# Altium project OSD335-X_Devboard.PrjPcb (part 2 of 3)

## Sheet P03_UART_Debug.SchDoc
size A4
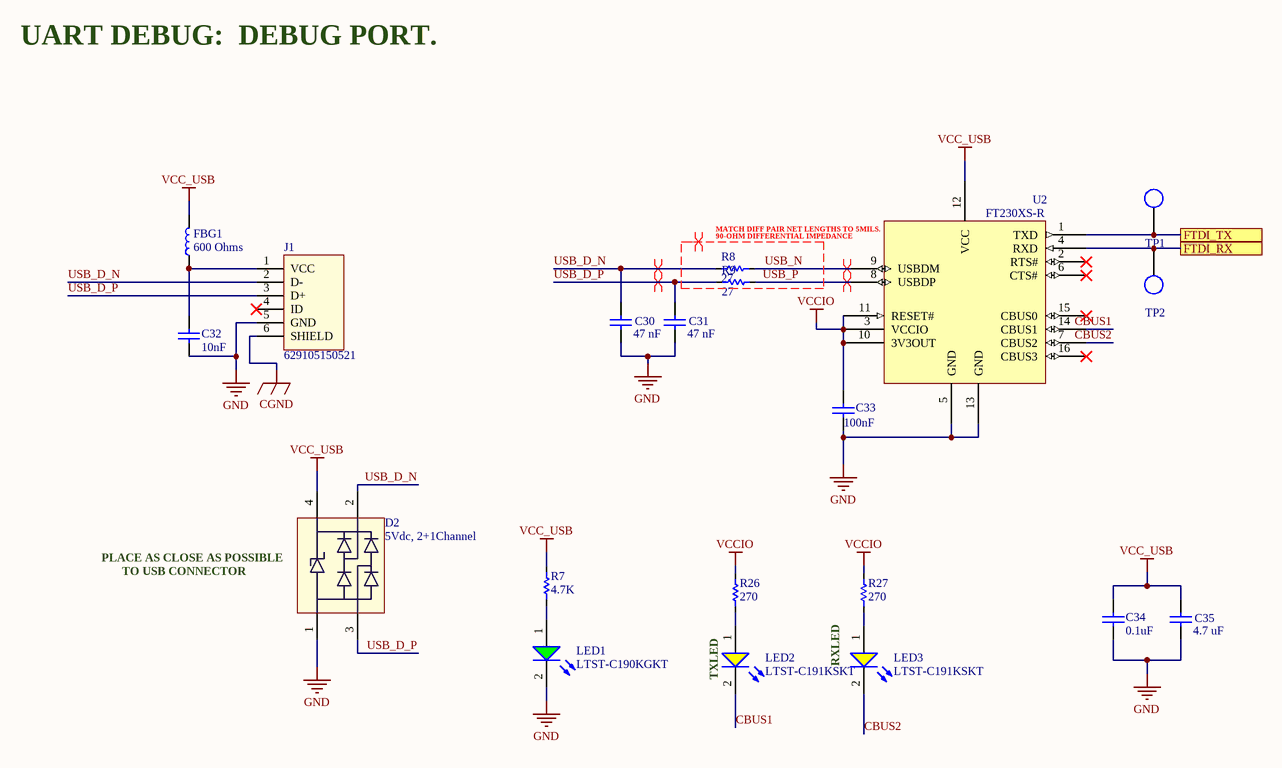
[diagram p4: P03_UART_Debug.SchDoc]

### Parts
C30  47 nF  [CAP_0603]
C31  47 nF  [CAP_0603]
C32  10nF  [CAP_0603]
C33  100nF  [CAP_0603]
C34  0.1uF  [CAP_0603]
C35  4.7 uF  [CAP_0603]
D2  5Vdc, 2+1Channel  [SOT143-4L]
FBG1  600 Ohms  [CAP_0603]
J1  629105150521  [629105150521]
LED1  LTST-C190KGKT  [LED_0603]
LED2  LTST-C191KSKT  [LED_0603]
LED3  LTST-C191KSKT  [LED_0603]
R7  4.7K  [RES_0603]
R8  27  [RES_0603]
R9  27  [RES_0603]
R26  270  [RES_0603]
R27  270  [RES_0603]
TP1  TP_SMD  [TP_SMD]  (value not drawn)
TP2  TP_SMD  [TP_SMD]  (value not drawn)
U2  FT230XS-R  [SOP64P600X175-16N]

### Ports
FTDI_RX, FTDI_TX

### Nets
CGND: J1.6(SHIELD)
GND: C30.2(P) C31.2(P) C32.1 C33.1 C34.1 C35.1(N) D2.1(GND) J1.5(GND) LED1.2(C) U2.5(GND) U2.13(GND)
VCC_USB: C34.2 C35.2(P) D2.4(VDD) FBG1.2 R7.2 U2.12(VCC)
VCCIO: C33.2 R26.2 R27.2 U2.3(VCCIO) U2.10(3V3OUT) U2.11(RESET#)
CBUS1: LED2.2(C) U2.14(CBUS1)
CBUS2: LED3.2(C) U2.7(CBUS2)
USB_D_N: C30.1(N) D2.2(IO1) J1.2(D-) R8.1
USB_D_P: C31.1(N) D2.3(IO2) J1.3(D+) R9.1
USB_N: R8.2 U2.9(USBDM)
USB_P: R9.2 U2.8(USBDP)
NetC32_2: C32.2 FBG1.1 J1.1(VCC)
NetLED1_1: LED1.1(A) R7.1
NetLED2_1: LED2.1(A) R26.1
NetLED3_1: LED3.1(A) R27.1
NetTP1_1: TP1.1 U2.1(TXD) ; port FTDI_TX
NetTP2_1: TP2.1 U2.4(RXD) ; port FTDI_RX

Not connected (* = marked no-connect by the designer): J1 4(ID)*; U2 2(RTS#)* 6(CTS#)* 15(CBUS0)* 16(CBUS3)*

### Layout directives
differential pair; differential pair class USB; rule Matched Net Lengths [Tolerance = 5mil]: USB_D_N, USB_N
differential pair; net class Z90_DIFF: USB_N, USB_P
differential pair; differential pair class USB: USB_D_P, USB_P

### Notes on the sheet
- UART DEBUG:  DEBUG PORT.
- MATCH DIFF PAIR NET LENGTHS TO 5MILS.
- 90-OHM DIFFERENTIAL IMPEDANCE
- PLACE AS CLOSE AS POSSIBLE
- TO USB CONNECTOR
- (near LED2) TXLED
- (near LED3) RXLED

### Library data of the parts
C30 C31 = C0603C473K4RACTU: CAP CER 0.047UF 16V X7R 0603; Manufacturer: KEMET; Tolerance: 10%; Rated Voltage: 16 VDC; ComponentLink1Description: Manufacturer; ComponentLink1URL: http://www.we-online.de; ComponentLink2Description: Datasheet; ComponentLink2URL: https://katalog.we-online.com/pbs/datasheet/865080345012.pdf; Mounting Technology: SMD; Value: 47 nF; Manufacturer Part No.: C0603C473K4RACTU; Datasheet: https://api.kemet.com/component-edge/download/datasheet/C0603C473K4RACTU.pdf; Supplier: Digi-Key; Package Reference: CAP_0603; Supplier Part No.: 399-7932-2-ND; Package Description: 0603
C32 = C0603C104M4RACTU: CAP CER 10000PF 16V NPO 0805; Manufacturer: Yageo; Manufacturer Part No.: CC0805JKNPO7BN103; Ceramic Type: NP0; Tolerance: 5%; ComponentLink1Description: Manufacturer; ComponentLink1URL: http://www.we-online.de; Value: 10nF; Rated Voltage: 16V; Supplier Part No.: 311-4205-1-ND; Package Reference: CAP_0805; Package Description: 0805; Mounting Technology: SMD; Datasheet: https://www.yageo.com/upload/media/product/productsearch/datasheet/mlcc/UPY-GP_NP0_16V-to-50V_18.pdf; Supplier: Digi-Key; ComponentLink2Description: Datasheet; ComponentLink2URL: https://content.kemet.com/datasheets/KEM_C1002_X7R_SMD.pdf
C33 = C0603C104M4RACTU: CAP CER 100PF 16V NP0 0603; Manufacturer: KEMET; Manufacturer Part No.: C0603C101J4GAC7867; Ceramic Type: X7R; Tolerance: 5%; ComponentLink1Description: Manufacturer; ComponentLink1URL: http://www.we-online.de; Value: 100nF; Rated Voltage: 16V; Supplier Part No.: 399-14476-1-ND; Package Reference: CAP_0603; Package Description: 0603; Mounting Technology: SMD; Datasheet: https://api.kemet.com/component-edge/download/datasheet/C0603C101J4GACTU.pdf; Supplier: Digi-Key; ComponentLink2Description: Datasheet; ComponentLink2URL: https://content.kemet.com/datasheets/KEM_C1002_X7R_SMD.pdf
C34 = C0603C104K4PAC7867: CAP CER 0.1UF 16V X5R 0603; Manufacturer: KEMET; Tolerance: 5%; ComponentLink1Description: Manufacturer; ComponentLink1URL: http://www.we-online.de; Value: 0.1uF; Rated Voltage: 16V; Ceramic Type: X5R; Supplier Part No.: 399-14941-1-ND; Package Reference: CAP_0603; Package Description: 0603; Mounting Technology: SMD; Manufacturer Part No.: C0603C104K4PAC7867; Datasheet: https://api.kemet.com/component-edge/download/datasheet/C0603C104K4PAC7867.pdf; Supplier: Digi-Key; ComponentLink2Description: Datasheet; ComponentLink2URL: https://content.kemet.com/datasheets/KEM_C1002_X7R_SMD.pdf
C35 = C0603C473K4RACTU_1: CAP CER 4.7UF 16V X5R 0603; Manufacturer Part No.: GRM188R61C475KAAJD; Manufacturer: Murata Electronics; Tolerance: 10%; Rated Voltage: 16 VDC; ComponentLink1Description: Manufacturer; ComponentLink1URL: http://www.we-online.de; ComponentLink2Description: Datasheet; ComponentLink2URL: https://katalog.we-online.com/pbs/datasheet/865080345012.pdf; Mounting Technology: SMD; Value: 4.7 uF; Datasheet: https://search.murata.co.jp/Ceramy/image/img/A01X/G101/ENG/GRM188R61C475KAAJ-01.pdf; Supplier: Digi-Key; Package Reference: CAP_0603; Supplier Part No.: 490-10481-1-ND; Package Description: 0603
D2 = 8240026: TVS DIODE 5V 9V SOT143-4 ESD; Manufacturer: Wurth Elektronik; Reverse Breakdown Voltage min.: 6V; Channel: 2+1; Channel Input Capacitance: 1.2pF; Reverse Peak Pulse Current: 6A; Reverse Channel Leakage Current: 1uA; ComponentLink1Description: Manufacturer; ComponentLink1URL: http://www.we-online.de; ComponentLink2Description: Datasheet; ComponentLink2URL: https://katalog.we-online.com/pbs/datasheet/8240026.pdf; Mounting Technology: SMD; DC Operating Voltage: 5V; Supplier: Digi-Key; Manufacturer Part No.: 8240026; Supplier Part No.: 732-4470-1-ND; Datasheet: https://www.we-online.de/katalog/datasheet/8240026.pdf; Package Description: SOT143-4
FBG1 = Ferrite Bead Generic: 600 Ohms @ 100MHz Ferrite Bead 0603 2A 100mOhm; Manufacturer: Chilisin Electronics; Manufacturer Part No.: BBHV00160808601Y00; ComponentLink1Description: Manufacturer; ComponentLink1URL: http://www.we-online.de; Value: 600 Ohms; Supplier Part No.: 2184-BBHV00160808601Y00CT-ND; Package Reference: FB_0603; Package Description: 0603; Mounting Technology: SMD; Datasheet: https://www.chilisin.com/upload/media/product/emi_bead/file/BBHV_Series.pdf; Tolerance: -; Supplier: Digi-Key; ComponentLink2Description: Datasheet; ComponentLink2URL: https://content.kemet.com/datasheets/KEM_C1002_X7R_SMD.pdf; Rated Current: 2 A
J1 = 629105150521: CONN RCPT USB2.0 MICRO B SMD R/A; Manufacturer: Wurth Elektronik; ComponentLink1 Description: Manufacturer; ComponentLink2 Description: Datasheet; ComponentLink1URL: http://www.we-online.de; ComponentLink2URL: http://katalog.we-online.de/em/datasheet/629105150521.pdf; Supplier: Digi-Key; Mounting Technology: THRU/SMD; Supplier Part No.: 732-5960-1-ND; Package Description: MICRO USB TYPE B DEVICE RECEPTACLE; Manufacturer Part No.: 629105150521; Package Reference: 629105150521; Datasheet: https://www.we-online.de/katalog/datasheet/629105150521.pdf
LED1 = LTST-C190KGKT: LED GREEN CLEAR CHIP SMD 0603; Manufacturer: Lite-On Inc.; Vf: 2V; Test Current: 20 mA; ComponentLink1Description: Manufacturer; ComponentLink1URL: http://www.we-online.de; ComponentLink2Description: Datasheet; ComponentLink2URL: http://katalog.we-online.com/led/datasheet/150080BS75000.pdf; Color: Green; Manufacturer Part No.: LTST-C190KGKT; Supplier: Digi-Key; Package Reference: LED_0603; Supplier Part No.: 160-1435-1-ND; Mounting Technology: SMD; Datasheet: http://optoelectronics.liteon.com/upload/download/DS22-2000-074/LTST-C190KGKT.PDF
LED2 LED3 = LTST-C191KSKT: LED YELLOW CLEAR SMD 0603; Manufacturer: Lite-On Inc.; Vf: 2.1V; Test Current: 20 mA; ComponentLink1Description: Manufacturer; ComponentLink1URL: http://www.we-online.de; ComponentLink2Description: Datasheet; ComponentLink2URL: http://katalog.we-online.com/led/datasheet/150080BS75000.pdf; Color: Yellow; Manufacturer Part No.: LTST-C191KSKT; Supplier: Digi-Key; Package Reference: LED_0603; Supplier Part No.: 160-1448-1-ND; Mounting Technology: SMD; Datasheet: http://optoelectronics.liteon.com/upload/download/DS22-2000-224/LTST-C191KSKT.PDF
R7 = RC0603JR-074K7L: RES SMD 4.7K OHM 5% 1/10W 0603; Manufacturer: Yageo; Value: 4.7K; Tolerance: 5%; Manufacturer Part No.: RC0603JR-074K7L; Date: 2020; ComponentLink1Description: Manufacturer Link; ComponentLink1URL: http://www.vishay.com/company/brands/dale/; ComponentLink2Description: Datasheet; ComponentLink2URL: http://www.vishay.com/docs/20035/dcrcwe3.pdf; Supplier: Digikey; Supplier Part No.: 311-4.7KGRCT-ND; Datasheet: https://www.yageo.com/upload/media/product/productsearch/datasheet/rchip/PYu-RC_Group_51_RoHS_L_10.pdf; Package Reference: RES_0603; Package Description: 0603; Mounting Technology: SMD; Power Rating: 1/10W
R8 R9 = RC0603JR-0727RL: RES SMD 27 OHM 5% 1/10W 0603; Manufacturer: Yageo; Value: 27; Tolerance: 5%; Manufacturer Part No.: RC0603JR-0727RL; Date: 2020; ComponentLink1Description: Manufacturer Link; ComponentLink1URL: http://www.vishay.com/company/brands/dale/; ComponentLink2Description: Datasheet; ComponentLink2URL: http://www.vishay.com/docs/20035/dcrcwe3.pdf; Supplier: Digikey; Supplier Part No.: 311-27GRCT-ND; Datasheet: https://www.yageo.com/upload/media/product/productsearch/datasheet/rchip/PYu-RC_Group_51_RoHS_L_10.pdf; Package Reference: RES_0603; Package Description: 0603; Mounting Technology: SMD
R26 R27 = RC0603JR-07270RL: RES SMD 270 OHM 5% 1/10W 0603; Manufacturer: Yageo; Tolerance: 5%; Manufacturer Part No.: RC0603JR-07270RL; Date: 2020; ComponentLink1Description: Manufacturer Link; ComponentLink1URL: http://www.vishay.com/company/brands/dale/; ComponentLink2Description: Datasheet; ComponentLink2URL: http://www.vishay.com/docs/20035/dcrcwe3.pdf; Supplier: Digikey; Supplier Part No.: 311-270GRCT-ND; Datasheet: https://www.yageo.com/upload/media/product/productsearch/datasheet/rchip/PYu-RC_Group_51_RoHS_L_10.pdf; Package Reference: RES_0603; Package Description: 0603; Mounting Technology: SMD; Power Rating: 1/10W; Value: 270
U2 = FT230XS-R: IC USB SERIAL BASIC UART 16SSOP; Manufacturer: FTDI, Future Technology Devices International Ltd; Manufacturer Part No.: FT230XS-R; Supplier: Digi-Key; Mounting Technology: SMD; Supplier Part No.: 768-1135-1-ND; Datasheet: https://www.ftdichip.com/Support/Documents/DataSheets/ICs/DS_FT230X.pdf; Package Reference: SSOP-16; Package Description: USB Bridge, USB to UART USB 2.0 UART Interface 16-SSOP; ComponentLink1Description: Datasheet; ComponentLink1URL: https://www.ftdichip.com/Support/Documents/DataSheets/ICs/DS_FT230X.pdf

## Sheet HDMI.SchDoc
size A4
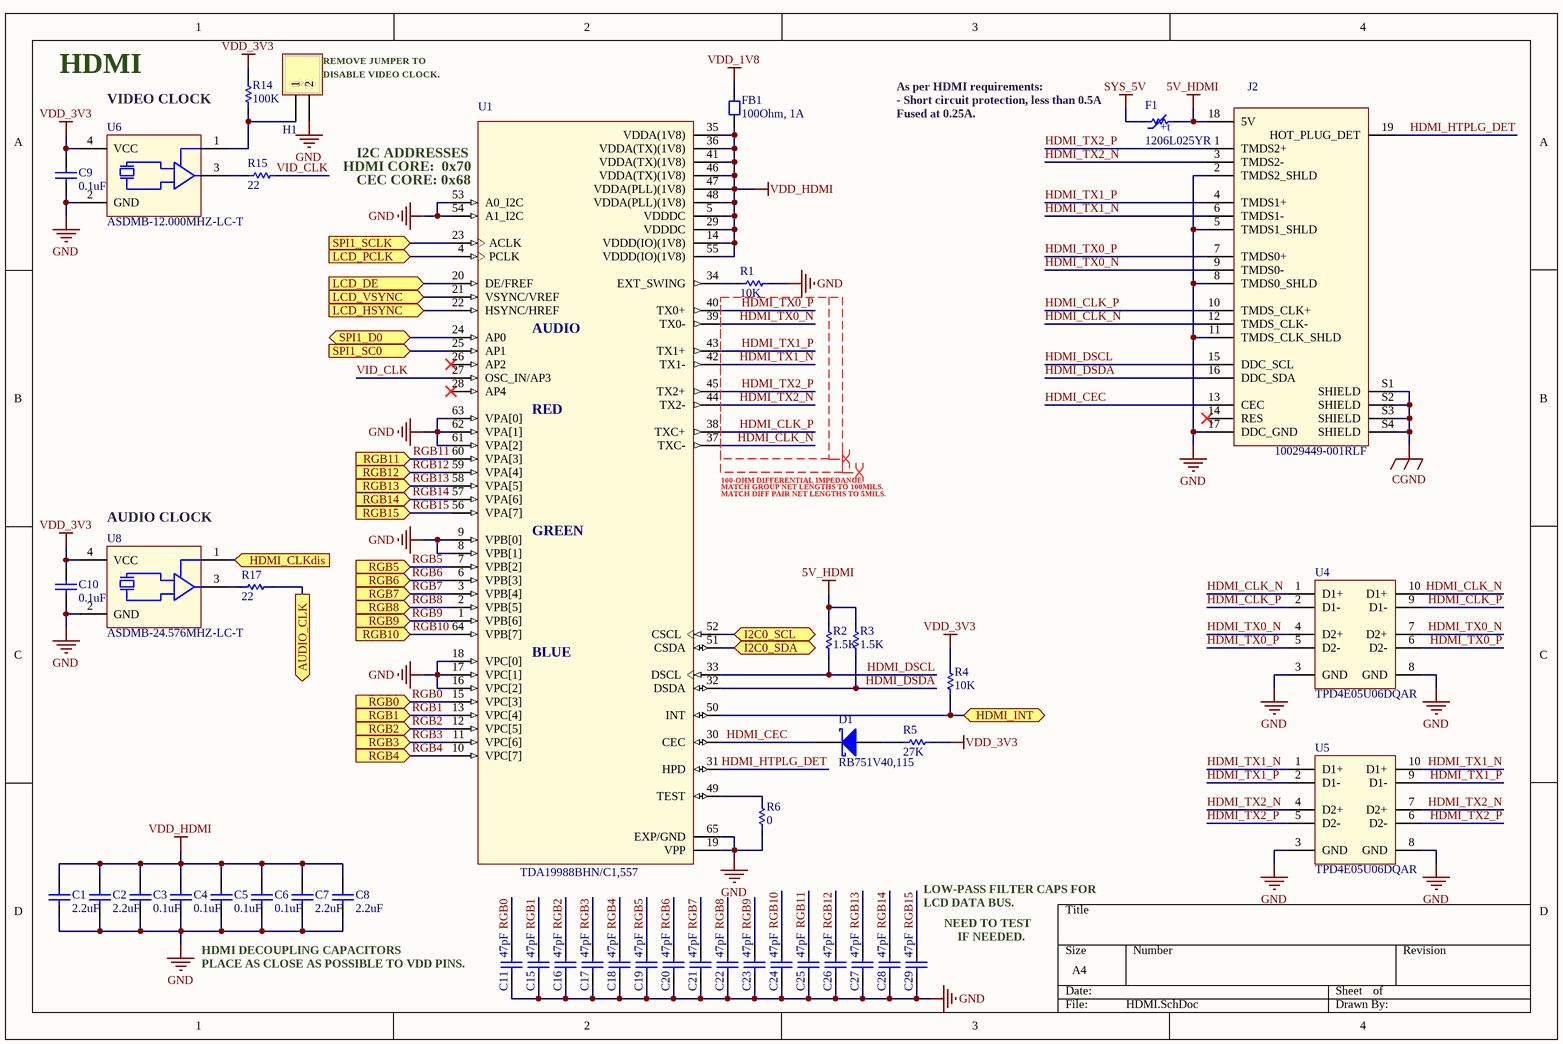
[diagram p5: HDMI.SchDoc]

### Parts
C1  2.2uF  [CAP_0603]
C2  2.2uF  [CAP_0603]
C3  0.1uF  [CAP_0603]
C4  0.1uF  [CAP_0603]
C5  0.1uF  [CAP_0603]
C6  0.1uF  [CAP_0603]
C7  2.2uF  [CAP_0603]
C8  2.2uF  [CAP_0603]
C9  0.1uF  [CAP_0603]
C10  0.1uF  [CAP_0603]
C11  47pF  [CAP_0402]
C15  47pF  [CAP_0402]
C16  47pF  [CAP_0402]
C17  47pF  [CAP_0402]
C18  47pF  [CAP_0402]
C19  47pF  [CAP_0402]
C20  47pF  [CAP_0402]
C21  47pF  [CAP_0402]
C22  47pF  [CAP_0402]
C23  47pF  [CAP_0402]
C24  47pF  [CAP_0402]
C25  47pF  [CAP_0402]
C26  47pF  [CAP_0402]
C27  47pF  [CAP_0402]
C28  47pF  [CAP_0402]
C29  47pF  [CAP_0402]
D1  RB751V40,115  [SOD-323]
F1  1206L025YR  [RES_1206]
FB1  100Ohm, 1A  [CAP_0603]
H1  02p  [HEADER_2X1_2.54MM]  (value not drawn)
J2  10029449-001RLF  [10029449-001RLF]
R1  10K  [RES_0603]
R2  1.5K  [RES_0603]
R3  1.5K  [RES_0603]
R4  10K  [RES_0603]
R5  27K  [RES_0603]
R6  0  [RES_0603]
R14  100K  [RES_0603]
R15  22  [RES_0603]
R17  22  [RES_0603]
U1  TDA19988BHN/C1,557  [HVQFN-64_9x9MM]
U4  TPD4E05U06DQAR  [USON-10_2.5X1MM]
U5  TPD4E05U06DQAR  [USON-10_2.5X1MM]
U6  ASDMB-12.000MHZ-LC-T  [ABRACON_4SMD_QFN]
U8  ASDMB-24.576MHZ-LC-T  [ABRACON_4SMD_QFN]

### Ports
AUDIO_CLK (out), HDMI_CLKdis (in), HDMI_INT (bidir), I2C0_SCL (bidir), I2C0_SDA (bidir), LCD_DE (in), LCD_HSYNC (in), LCD_PCLK (in), LCD_VSYNC (in), RGB0 (in), RGB1 (in), RGB2 (in), RGB3 (in), RGB4 (in), RGB5 (in), RGB6 (in), RGB7 (in), RGB8 (in), RGB9 (in), RGB10 (in), RGB11 (in), RGB12 (in), RGB13 (in), RGB14 (in), RGB15 (in), SPI1_D0 (bidir), SPI1_SC0 (in), SPI1_SCLK (in)

### Nets
5V_HDMI: F1.2 J2.18(5V) R2.2 R3.2
CGND: J2.S1(SHIELD) J2.S2(SHIELD) J2.S3(SHIELD) J2.S4(SHIELD)
GND: C1.1 C2.1 C3.1 C4.1 C5.1 C6.1 C7.1 C8.1 C9.1 C10.1 C11.1(N) C15.1(N) C16.1(N) C17.1(N) C18.1(N) C19.1(N) C20.1(N) C21.1(N) C22.1(N) C23.1(N) C24.1(N) C25.1(N) C26.1(N) C27.1(N) C28.1(N) C29.1(N) H1.2 J2.2(TMDS2_SHLD) J2.5(TMDS1_SHLD) J2.8(TMDS0_SHLD) J2.11(TMDS_CLK_SHLD) J2.17(DDC_GND) R1.1 R6.1 U1.8(VPB[1]) U1.9(VPB[0]) U1.16(VPC[2]) U1.17(VPC[1]) U1.18(VPC[0]) U1.19(VPP) U1.53(A0_I2C) U1.54(A1_I2C) U1.61(VPA[2]) U1.62(VPA[1]) U1.63(VPA[0]) U1.65(EXP/GND) U4.3(GND) U4.8(GND) U5.3(GND) U5.8(GND) U6.2(GND) U8.2(GND)
SYS_5V: F1.1
VDD_1V8: FB1.2
VDD_3V3: C9.2 C10.2 R4.2 R5.2 R14.2 U6.4(VCC) U8.4(VCC)
VDD_HDMI: C1.2 C2.2 C3.2 C4.2 C5.2 C6.2 C7.2 C8.2 FB1.1 U1.5(VDDDC) U1.14(VDDD(IO)(1V8)) U1.29(VDDDC) U1.35(VDDA(1V8)) U1.36(VDDA(TX)(1V8)) U1.41(VDDA(TX)(1V8)) U1.46(VDDA(TX)(1V8)) U1.47(VDDA(PLL)(1V8)) U1.48(VDDA(PLL)(1V8)) U1.55(VDDD(IO)(1V8))
HDMI_CEC: D1.2(K) J2.13(CEC) U1.30(CEC)
HDMI_CLK_N: J2.12(TMDS_CLK-) U1.37(TXC-) U4.1(D1+) U4.10(D1+)
HDMI_CLK_P: J2.10(TMDS_CLK+) U1.38(TXC+) U4.2(D1-) U4.9(D1-)
HDMI_DSCL: J2.15(DDC_SCL) R2.1 U1.33(DSCL)
HDMI_DSDA: J2.16(DDC_SDA) R3.1 U1.32(DSDA)
HDMI_HTPLG_DET: J2.19(HOT_PLUG_DET) U1.31(HPD)
HDMI_TX0_N: J2.9(TMDS0-) U1.39(TX0-) U4.4(D2+) U4.7(D2+)
HDMI_TX0_P: J2.7(TMDS0+) U1.40(TX0+) U4.5(D2-) U4.6(D2-)
HDMI_TX1_N: J2.6(TMDS1-) U1.42(TX1-) U5.1(D1+) U5.10(D1+)
HDMI_TX1_P: J2.4(TMDS1+) U1.43(TX1+) U5.2(D1-) U5.9(D1-)
HDMI_TX2_N: J2.3(TMDS2-) U1.44(TX2-) U5.4(D2+) U5.7(D2+)
HDMI_TX2_P: J2.1(TMDS2+) U1.45(TX2+) U5.5(D2-) U5.6(D2-)
RGB0: C11.2(P) U1.15(VPC[3]) ; port RGB0
RGB1: C15.2(P) U1.13(VPC[4]) ; port RGB1
RGB2: C16.2(P) U1.12(VPC[5]) ; port RGB2
RGB3: C17.2(P) U1.11(VPC[6]) ; port RGB3
RGB4: C18.2(P) U1.10(VPC[7]) ; port RGB4
RGB5: C19.2(P) U1.7(VPB[2]) ; port RGB5
RGB6: C20.2(P) U1.6(VPB[3]) ; port RGB6
RGB7: C21.2(P) U1.3(VPB[4]) ; port RGB7
RGB8: C22.2(P) U1.2(VPB[5]) ; port RGB8
RGB9: C23.2(P) U1.1(VPB[6]) ; port RGB9
RGB10: C24.2(P) U1.64(VPB[7]) ; port RGB10
RGB11: C25.2(P) U1.60(VPA[3]) ; port RGB11
RGB12: C26.2(P) U1.59(VPA[4]) ; port RGB12
RGB13: C27.2(P) U1.58(VPA[5]) ; port RGB13
RGB14: C28.2(P) U1.57(VPA[6]) ; port RGB14
RGB15: C29.2(P) U1.56(VPA[7]) ; port RGB15
VID_CLK: R15.2 U1.27(OSC_IN/AP3)
NetD1_1: D1.1(A) R5.1
NetH1_1: H1.1 R14.1 U6.1(STDBY)
NetR1_2: R1.2 U1.34(EXT_SWING)
NetR4_1: R4.1 U1.50(INT) ; port HDMI_INT
NetR6_2: R6.2 U1.49(TEST)
NetR10_2: U1.4(PCLK) ; port LCD_PCLK
NetR11_2: U1.21(VSYNC/VREF) ; port LCD_VSYNC
NetR12_2: U1.22(HSYNC/HREF) ; port LCD_HSYNC
NetR13_2: U1.20(DE/FREF) ; port LCD_DE
NetR15_1: R15.1 U6.3(OUT)
NetR17_1: R17.1 U8.3(OUT)
NetR17_2: R17.2 ; port AUDIO_CLK
NetR19_1: U1.51(CSDA) ; port I2C0_SDA
NetR20_1: U1.52(CSCL) ; port I2C0_SCL
NetU1_23: U1.23(ACLK) ; port SPI1_SCLK
NetU1_24: U1.24(AP0) ; port SPI1_D0
NetU1_25: U1.25(AP1) ; port SPI1_SC0
NetU3_T16: U8.1(STDBY) ; port HDMI_CLKdis

Not connected (* = marked no-connect by the designer): J2 14(RES)*; U1 26(AP2)* 28(AP4)*

### Layout directives
differential pair; differential pair class TMDS; rule Matched Net Lengths [Tolerance = 5mil]: HDMI_CLK_N, HDMI_CLK_P, HDMI_TX0_N, HDMI_TX0_P, HDMI_TX1_N, HDMI_TX1_P, HDMI_TX2_N, HDMI_TX2_P
differential pair; differential pair class Z100_DIFF; rule Matched Net Lengths [Tolerance = 100mil]: HDMI_CLK_N, HDMI_CLK_P, HDMI_TX0_N, HDMI_TX0_P, HDMI_TX1_N, HDMI_TX1_P, HDMI_TX2_N, HDMI_TX2_P

### Notes on the sheet
- HDMI
- VIDEO CLOCK
- (near H1) REMOVE JUMPER TO
- (near H1) DISABLE VIDEO CLOCK.
- As per HDMI requirements:
- (near F1) - Short circuit protection, less than 0.5A
- Fused at 0.25A.
- (near U1) HDMI CORE:  0x70
- (near U1) I2C ADDRESSES
- (near U1) CEC CORE: 0x68
- (near U1) AUDIO
- (near U1) RED
- (near U8) AUDIO CLOCK
- (near U1) 100-OHM DIFFERENTIAL IMPEDANCE
- (near U1) MATCH GROUP NET LENGTHS TO 100MILS.
- (near U1) MATCH DIFF PAIR NET LENGTHS TO 5MILS.
- (near U1) GREEN
- (near U1) BLUE
- LOW-PASS FILTER CAPS FOR
- LCD DATA BUS.
- NEED TO TEST
- HDMI DECOUPLING CAPACITORS
- PLACE AS CLOSE AS POSSIBLE TO VDD PINS.
- (near C29) IF NEEDED.
- (in symbol 1206L025YR) +t

### Library data of the parts
C1 C2 C7 C8 = C0603C225M4PAC7867: CAP CER 2.2UF 16V X5R 0603; Manufacturer: KEMET; Manufacturer Part No.: C0603C104M4RACTU; Tolerance: 20%; ComponentLink1Description: Manufacturer; ComponentLink1URL: http://www.we-online.de; Value: 2.2uF; Rated Voltage: 16V; Ceramic Type: X5R; Supplier Part No.: 399-13136-1-ND; Package Reference: CAP_0603; Package Description: 0603; Mounting Technology: SMD; Datasheet: https://content.kemet.com/datasheets/KEM_C1002_X7R_SMD.pdf; Supplier: Digi-Key; ComponentLink2Description: Datasheet; ComponentLink2URL: https://content.kemet.com/datasheets/KEM_C1002_X7R_SMD.pdf
C3-C6 C9 C10 = C0603C104M4RACTU: CAP CER 0.1UF 16V X7R 0603; Manufacturer: KEMET; Tolerance: 20%; ComponentLink1Description: Manufacturer; ComponentLink1URL: http://www.we-online.de; Value: 0.1uF; Rated Voltage: 16V; Ceramic Type: X7R; Supplier Part No.: 399-1099-1-ND; Package Reference: CAP_0603; Package Description: 0603; Mounting Technology: SMD; Manufacturer Part No.: C0603C104M4RACTU; Datasheet: https://content.kemet.com/datasheets/KEM_C1002_X7R_SMD.pdf; Supplier: Digi-Key; ComponentLink2Description: Datasheet; ComponentLink2URL: https://content.kemet.com/datasheets/KEM_C1002_X7R_SMD.pdf
C11 C15-C29 = 885012005011: CAP CER 47PF 10V C0G/NP0 0402; Manufacturer: Wurth Elektronik; Tolerance: 5%; Rated Voltage: 10 VDC; ComponentLink1Description: Manufacturer; ComponentLink1URL: http://www.we-online.de; ComponentLink2Description: Datasheet; ComponentLink2URL: https://katalog.we-online.com/pbs/datasheet/865080345012.pdf; Mounting Technology: SMD; Value: 47 pF; Manufacturer Part No.: 885012005011; Datasheet: https://katalog.we-online.de/pbs/datasheet/885012005011.pdf; Supplier: Digi-Key; Package Reference: CAP_0402; Supplier Part No.: 732-7429-1-ND; Package Description: 0402
D1 = RB751V40,115: DIODE SCHOTTKY 40V 120MA SOD323; Manufacturer: Nexperia USA Inc.; Forward Voltage: 0.37V; Mounting Technology: SMD; Supplier Part No.: 1727-6301-1-ND; Manufacturer Part No.: RB751V40,115; Package Reference: *; Package Description: *; Forward Current: 120mA; Supplier: Digi-Key
F1 = 1206L025YR: PTC RESET FUSE 16V 250MA 1206; Manufacturer: Littelfuse Inc.; Rated Current: 0.25A; Manufacturer Part No.: 1206L025YR; Supplier: Digi-Key; Mounting Technology: SMD; Supplier Part No.: F2110CT-ND; Package Description: Polymeric PTC Resettable Fuse 16V 250mA Ih Surface Mount 1206 (3216 Metric), Concave; Package Reference: CAP_1206; Datasheet: https://www.littelfuse.com/~/media/electronics/datasheets/resettable_ptcs/littelfuse_ptc_1206l_datasheet.pdf.pdf
FB1 = MPZ1608D101BTA00: FERRITE BEAD 100 OHM 0603 1LN; Manufacturer: TDK Corporation; Datasheet: https://product.tdk.com/info/en/catalog/datasheets/beads_commercial_power_mpz1608_en.pdf; Manufacturer Part No.: MPZ1608D101BTA00; Supplier: Digi-Key; Package Description: 100 Ohms @ 100MHz 1 Power Line Ferrite Bead 0603 (1608 Metric) 1A 150mOhm; Supplier Part No.: 445-2988-1-ND; Package Reference: CAP_0603; Mounting Technology: SMD
H1 = 61300211121: CONN HEADER VERT 2POS 2.54MM; Manufacturer: Wurth Elektronik; ComponentLink1Description: Manufacturer; ComponentLink1URL: http://www.we-online.de; ComponentLink2Description: Datasheet; ComponentLink2URL: http://katalog.we-online.de/em/datasheet/6130xx11121.pdf; Supplier Part No.: 732-5315-ND; Supplier: Digi-Key; Package Reference: HEADER_2X1_2.54MM; Package Description: Header 2-pin 2.54mm 100mils; Mounting Technology: THRU; Manufacturer Part No.: 61300211121; Datasheet: https://www.we-online.de/katalog/datasheet/6130xx11121.pdf
J2 = 10029449-001RLF: CONN RCPT 1.4 HDMI 19POS SMD R/A; Manufacturer: Amphenol ICC (FCI); Supplier: Digi-Key; Manufacturer Part No.: 10029449-001RLF; Supplier Part No.: 609-1010-1-ND; Mounting Technology: THRU; Package Reference: 10029449-001RLF; Package Description: HDMI HDMI™ 1.4 Receptacle Connector 19 Position Surface Mount, Right Angle; Through Hole; Datasheet: https://cdn.amphenol-icc.com/media/wysiwyg/files/documentation/datasheet/inputoutput/io_hdmi_receptacles.pdf
R1 R4 = RC0603FR-0710KL: RES SMD 10K OHM 1% 1/10W 0603; Manufacturer: Yageo; Tolerance: 1%; Manufacturer Part No.: RC0603FR-0710KL; Date: 2020; ComponentLink1Description: Manufacturer Link; ComponentLink1URL: http://www.vishay.com/company/brands/dale/; ComponentLink2Description: Datasheet; ComponentLink2URL: http://www.vishay.com/docs/20035/dcrcwe3.pdf; Supplier: Digikey; Supplier Part No.: 311-10.0KHRCT-ND; Datasheet: https://www.yageo.com/upload/media/product/productsearch/datasheet/rchip/PYu-RC_Group_51_RoHS_L_10.pdf; Package Reference: RES_0603; Package Description: 0603; Mounting Technology: SMD; Value: 10K; Power Rating: 1/10W
R2 R3 = RC0603FR-071K5L: RES SMD 1.5K OHM 1% 1/10W 0603; Manufacturer: Yageo; Tolerance: 1%; Manufacturer Part No.: RC0603FR-071K5L; Date: 2020; ComponentLink1Description: Manufacturer Link; ComponentLink1URL: http://www.vishay.com/company/brands/dale/; ComponentLink2Description: Datasheet; ComponentLink2URL: http://www.vishay.com/docs/20035/dcrcwe3.pdf; Supplier: Digikey; Supplier Part No.: 311-1.50KHRCT-ND; Datasheet: https://www.yageo.com/upload/media/product/productsearch/datasheet/rchip/PYu-RC_Group_51_RoHS_L_10.pdf; Package Reference: RES_0603; Package Description: 0603; Mounting Technology: SMD; Value: 1.5K; Power Rating: 1/10W
R5 = RC0603FR-0727KL: RES SMD 27K OHM 1% 1/10W 0603; Manufacturer: Yageo; Tolerance: 1%; Manufacturer Part No.: RC0603FR-0727KL; Date: 2020; ComponentLink1Description: Manufacturer Link; ComponentLink1URL: http://www.vishay.com/company/brands/dale/; ComponentLink2Description: Datasheet; ComponentLink2URL: http://www.vishay.com/docs/20035/dcrcwe3.pdf; Supplier: Digikey; Supplier Part No.: 311-27.0KHRCT-ND; Datasheet: https://www.yageo.com/upload/media/product/productsearch/datasheet/rchip/PYu-RC_Group_51_RoHS_L_10.pdf; Package Reference: RES_0603; Package Description: 0603; Mounting Technology: SMD; Value: 27K; Power Rating: 1/10W
R6 = RC0603JR-070RL: RES SMD 0 OHM JUMPER 1/10W 0603; Manufacturer: Yageo; Manufacturer Part No.: RC0603JR-070RL; Date: 2020; ComponentLink1Description: Manufacturer Link; ComponentLink1URL: http://www.vishay.com/company/brands/dale/; ComponentLink2Description: Datasheet; ComponentLink2URL: http://www.vishay.com/docs/20035/dcrcwe3.pdf; Supplier: Digikey; Supplier Part No.: 311-0.0GRCT-ND; Datasheet: https://www.yageo.com/upload/media/product/productsearch/datasheet/rchip/PYu-RC_Group_51_RoHS_L_10.pdf; Package Reference: RES_0603; Package Description: 0603; Mounting Technology: SMD; Value: 0; Power Rating: 1/10W
R14 = RC0603FR-07100KL: RES SMD 100K OHM 1% 1/10W 0603; Manufacturer: Yageo; Tolerance: 1%; Manufacturer Part No.: RC0603FR-07100KL; Date: 2020; ComponentLink1Description: Manufacturer Link; ComponentLink1URL: http://www.vishay.com/company/brands/dale/; ComponentLink2Description: Datasheet; ComponentLink2URL: http://www.vishay.com/docs/20035/dcrcwe3.pdf; Supplier: Digikey; Supplier Part No.: 311-100KHRCT-ND; Datasheet: https://www.yageo.com/upload/media/product/productsearch/datasheet/rchip/PYu-RC_Group_51_RoHS_L_10.pdf; Package Reference: RES_0603; Package Description: 0603; Mounting Technology: SMD; Value: 100K; Power Rating: 1/10W
R15 R17 = RC0603JR-0722RL: RES SMD 22 OHM 5% 1/10W 0603; Manufacturer: Yageo; Tolerance: 5%; Manufacturer Part No.: RC0603JR-0722RL; Date: 2020; ComponentLink1Description: Manufacturer Link; ComponentLink1URL: http://www.vishay.com/company/brands/dale/; ComponentLink2Description: Datasheet; ComponentLink2URL: http://www.vishay.com/docs/20035/dcrcwe3.pdf; Supplier: Digikey; Supplier Part No.: 311-22GRCT-ND; Datasheet: https://www.yageo.com/upload/media/product/productsearch/datasheet/rchip/PYu-RC_Group_51_RoHS_L_10.pdf; Package Reference: RES_0603; Package Description: 0603; Mounting Technology: SMD; Power Rating: 1/10W; Value: 22
U1 = TDA19988BHN: IC VIDEO HDMI TRANS 64HVQFN; Manufacturer: NXP USA Inc.; Manufacturer Part No.: TDA19988BHN/C1,557; Supplier: Digi-Key; Package Reference: HVQFN-64_9x9MM; Supplier Part No.: 568-12059-ND; Package Description: Video  IC   64-HVQFN (9x9) Package; Mounting Technology: SMD; ComponentLink1Description: Datasheet; ComponentLink1URL: https://media.digikey.com/pdf/Data%20Sheets/NXP%20PDFs/TDA19988_DS_21_july_2011.pdf
U4 U5 = TPD4E05U06DQAR: TVS DIODE 5.5V 14V 10SON; Manufacturer: Texas Instruments; Supplier: Digi-Key; Manufacturer Part No.: TPD4E05U06DQAR; Supplier Part No.: 296-35765-1-ND; Package Reference: USON-10; Package Description: 14V Clamp 2.5A (8/20µs) Ipp Tvs Diode Surface Mount 10-USON (2.5x1); Mounting Technology: SMD; Datasheet: https://www.ti.com/lit/ds/symlink/tpd4e05u06.pdf
U6 = ASDMB-12.000MHZ-LC-T: MEMS OSC XO 12.0000MHZ LVCMOS; Manufacturer: Abracon LLC; Supplier: Digi-Key; Manufacturer Part No.: ASDMB-12.000MHZ-LC-T; Supplier Part No.: 535-11724-1-ND; Mounting Technology: SMD; Package Reference: ABRACON_4SMD_QFN; Package Description: QFN-4, ABRACON 4-SMD; Datasheet: https://abracon.com/Oscillators/ASDMB.pdf
U8 = ASDMB-24.576MHZ-LC-T: MEMS OSC XO 24.5760MHZ LVCMOS; Manufacturer: Abracon LLC; Supplier: Digi-Key; Manufacturer Part No.: ASDMB-24.576MHZ-LC-T; Supplier Part No.: 535-11729-1-ND; Mounting Technology: SMD; Package Reference: ABRACON_4SMD_QFN; Package Description: QFN-4, ABRACON 4-SMD; Datasheet: https://abracon.com/Oscillators/ASDMB.pdf

## Sheet P04_USB_hub.SchDoc
size A4
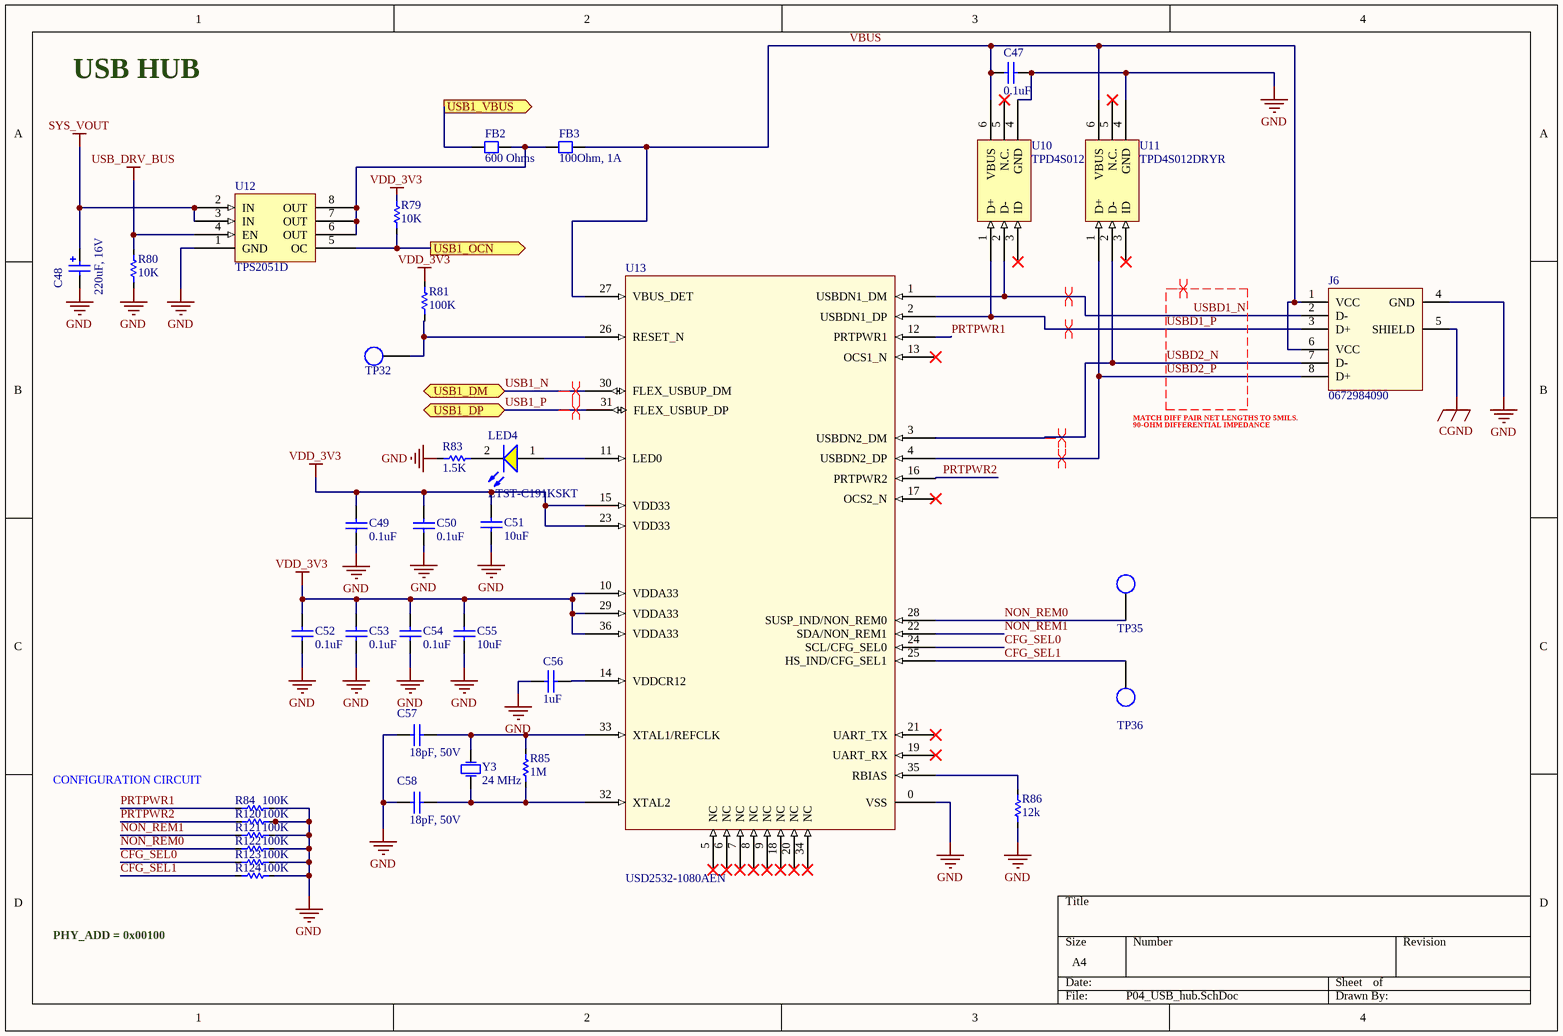
[diagram p6: P04_USB_hub.SchDoc]

### Parts
C47  0.1uF  [CAP_0603]
C48  220uF, 16V  [CAP_SMD_6.3x7.7]
C49  0.1uF  [CAP_0603]
C50  0.1uF  [CAP_0603]
C51  10uF  [CAP_0603]
C52  0.1uF  [CAP_0603]
C53  0.1uF  [CAP_0603]
C54  0.1uF  [CAP_0603]
C55  10uF  [CAP_0603]
C56  1uF  [CAP_0603]
C57  18pF, 50V  [CAP_0603]
C58  18pF, 50V  [CAP_0603]
FB2  600 Ohms  [CAP_0603]
FB3  100Ohm, 1A  [CAP_0603]
J6  0672984090  [Dual USB Connector Molex]
LED4  LTST-C191KSKT  [LED_0603]
R79  10K  [RES_0603]
R80  10K  [RES_0603]
R81  100K  [RES_0603]
R83  1.5K  [RES_0603]
R84  100K  [RES_0603]
R85  1M  [RES_0603]
R86  12k  [RES_0603]
R120  100K  [RES_0603]
R121  100K  [RES_0603]
R122  100K  [RES_0603]
R123  100K  [RES_0603]
R124  100K  [RES_0603]
TP32  TP_SMD  [TP_SMD]  (value not drawn)
TP35  TP_SMD  [TP_SMD]  (value not drawn)
TP36  TP_SMD  [TP_SMD]  (value not drawn)
U10  TPD4S012DRYR  [SON50P100X60-6N]
U11  TPD4S012DRYR  [SON50P100X60-6N]
U12  TPS2051D  [SOIC127P600X175-8N]
U13  USD2532-1080AEN  [DUAL_USB_HUB]
Y3  24 MHz  [7A-24MHz]

### Ports
USB1_DM (bidir), USB1_DP (bidir), USB1_OCN (out), USB1_VBUS (out)

### Nets
CGND: J6.5(SHIELD)
GND: C47.2 C48.1(N) C49.1 C50.1 C51.1 C52.1 C53.1 C54.1 C55.1 C56.1 C57.1(N) C58.1(N) J6.4(GND) R80.1 R83.1 R84.2 R86.1 R120.2 R121.2 R122.2 R123.2 R124.2 U10.4(GND) U11.4(GND) U12.1(GND) U13.0(VSS)
SYS_VOUT: C48.2(P) U12.2(IN) U12.3(IN)
USB_DRV_BUS: R80.2 U12.4(EN)
VDD_3V3: C49.2 C50.2 C51.2 C52.2 C53.2 C54.2 C55.2 R79.2 R81.2 U13.10(VDDA33) U13.15(VDD33) U13.23(VDD33) U13.29(VDDA33) U13.36(VDDA33)
CFG_SEL0: R123.1 U13.24(SCL/CFG_SEL0)
CFG_SEL1: R124.1 TP36.1 U13.25(HS_IND/CFG_SEL1)
NON_REM0: R122.1 TP35.1 U13.28(SUSP_IND/NON_REM0)
NON_REM1: R121.1 U13.22(SDA/NON_REM1)
PRTPWR1: R84.1 U13.12(PRTPWR1)
PRTPWR2: R120.1 U13.16(PRTPWR2)
USB1_N: U13.30(FLEX_USBUP_DM) ; port USB1_DM
USB1_P: U13.31(FLEX_USBUP_DP) ; port USB1_DP
USBD1_N: J6.2(D-) U10.2(D-) U13.1(USBDN1_DM)
USBD1_P: J6.3(D+) U10.1(D+) U13.2(USBDN1_DP)
USBD2_N: J6.7(D-) U11.2(D-) U13.3(USBDN2_DM)
USBD2_P: J6.8(D+) U11.1(D+) U13.4(USBDN2_DP)
VBUS: C47.1 FB3.2 J6.1(VCC) J6.6(VCC) U10.6(VBUS) U11.6(VBUS) U13.27(VBUS_DET)
NetC56_2: C56.2 U13.14(VDDCR12)
NetC57_2: C57.2(P) R85.2 U13.33(XTAL1/REFCLK) Y3.2(OSC2)
NetC58_2: C58.2(P) R85.1 U13.32(XTAL2) Y3.1(OSC1)
NetFB2_1: FB2.1 ; port USB1_VBUS
NetFB2_2: FB2.2 FB3.1 U12.6(OUT) U12.7(OUT) U12.8(OUT)
NetLED4_1: LED4.1(A) U13.11(LED0)
NetLED4_2: LED4.2(C) R83.2
NetR79_1: R79.1 U12.5(OC) ; port USB1_OCN
NetR81_1: R81.1 TP32.1 U13.26(RESET_N)
NetR86_2: R86.2 U13.35(RBIAS)

Not connected (* = marked no-connect by the designer): U10 3(ID)* 5(N.C.)*; U11 3(ID)* 5(N.C.)*; U13 5(NC)* 6(NC)* 7(NC)* 8(NC)* 9(NC)* 13(OCS1_N)* 17(OCS2_N)* 18(NC)* 19(UART_RX)* 20(NC)* 21(UART_TX)* 34(NC)*

### Layout directives
differential pair; net class Z90_DIFF: USBD1_N, USBD1_P, USBD2_N, USBD2_P
differential pair: USBD1_N, USBD1_P, USBD2_N, USBD2_P
differential pair; differential pair class USB: USB1_N, USB1_P

### Notes on the sheet
- USB HUB
- MATCH DIFF PAIR NET LENGTHS TO 5MILS.
- 90-OHM DIFFERENTIAL IMPEDANCE
- CONFIGURATION CIRCUIT
- PHY_ADD = 0x00100

### Library data of the parts
C47 C49 C50 C52-C54 = C0603C104M4RACTU: as C3 on sheet HDMI; ComponentLink1Description: Manufacturer; ComponentLink1URL: http://www.we-online.de; Value: 0.1uF; Rated Voltage: 16V; Ceramic Type: X7R; Supplier Part No.: 399-1099-1-ND; Package Reference: CAP_0603; Package Description: 0603; Mounting Technology: SMD; Manufacturer Part No.: C0603C104M4RACTU; Datasheet: https://content.kemet.com/datasheets/KEM_C1002_X7R_SMD.pdf; Supplier: Digi-Key; ComponentLink2Description: Datasheet; ComponentLink2URL: https://content.kemet.com/datasheets/KEM_C1002_X7R_SMD.pdf
C48 = 865080345012: CAP 220 UF 20% 16 V; Manufacturer: Wurth Elektronik; Rated Voltage: 16 VDC; ComponentLink1Description: Manufacturer; ComponentLink1URL: http://www.we-online.de; ComponentLink2Description: Datasheet; ComponentLink2URL: https://katalog.we-online.com/pbs/datasheet/865080345012.pdf; Mounting Technology: SMD; Value: 220uF; Manufacturer Part No.: 865080345012; Tolerance: 20%; Datasheet: *; Supplier: Digi-Key; Package Reference: CAP_SMD_6.3x7.7; Supplier Part No.: 732-8422-1-ND; Package Description: CAP_SMD_6.3x7.7
C51 C55 = C0603C106M8PAC7867: CAP CER 10UF 10V X5R 0603; Manufacturer: KEMET; Ceramic Type: X7R; Tolerance: 20%; ComponentLink1Description: Manufacturer; ComponentLink1URL: http://www.we-online.de; Value: 10uF; Rated Voltage: 10V; Supplier Part No.: 399-14945-1-ND; Package Reference: CAP_0603; Package Description: 0603; Mounting Technology: SMD; Manufacturer Part No.: C0603C106M8PAC7867; Datasheet: https://content.kemet.com/datasheets/KEM_C1002_X7R_SMD.pdf; Supplier: Digi-Key; ComponentLink2Description: Datasheet; ComponentLink2URL: https://content.kemet.com/datasheets/KEM_C1002_X7R_SMD.pdf
C56 = C0603C105M4RACTU: CAP CER 1UF 16V X7R 0603; Manufacturer: KEMET; Tolerance: 20%; ComponentLink1Description: Manufacturer; ComponentLink1URL: http://www.we-online.de; Value: 1uF; Rated Voltage: 16V; Ceramic Type: X7R; Supplier Part No.: 399-11136-1-ND; Package Reference: CAP_0603; Package Description: 0603; Mounting Technology: SMD; Manufacturer Part No.: C0603C105M4RACTU; Datasheet: https://content.kemet.com/datasheets/KEM_C1002_X7R_SMD.pdf; Supplier: Digi-Key; ComponentLink2Description: Datasheet; ComponentLink2URL: https://content.kemet.com/datasheets/KEM_C1002_X7R_SMD.pdf
C57 C58 = C0603C180D5GACTU: CAP CER 18PF 50V C0G/NP0 0603 +/- 0.5 PF; Manufacturer: KEMET; Tolerance: 0.5 pF; Rated Voltage: 50 VDC; ComponentLink1Description: Manufacturer; ComponentLink1URL: http://www.we-online.de; ComponentLink2Description: Datasheet; ComponentLink2URL: https://katalog.we-online.com/pbs/datasheet/865080345012.pdf; Mounting Technology: SMD; Value: 18 pF; Manufacturer Part No.: C0603C180D5GACTU; Datasheet: *; Supplier: Digi-Key; Package Reference: CAP_0603; Supplier Part No.: 399-9018-1-ND; Package Description: 0603
FB2 = BBHV00160808601Y00: 600 Ohms @ 100MHz Ferrite Bead 0603 2A 100mOhm; Manufacturer: Chilisin Electronics; ComponentLink1Description: Manufacturer; ComponentLink1URL: http://www.we-online.de; Value: 600 Ohms; Rated Current: 2 A; Supplier Part No.: 2184-BBHV00160808601Y00CT-ND; Package Reference: FB_0603; Package Description: 0603; Mounting Technology: SMD; Manufacturer Part No.: BBHV00160808601Y00; Datasheet: https://www.chilisin.com/upload/media/product/emi_bead/file/BBHV_Series.pdf; Tolerance: -; Supplier: Digi-Key; ComponentLink2Description: Datasheet; ComponentLink2URL: https://content.kemet.com/datasheets/KEM_C1002_X7R_SMD.pdf
FB3 = MPZ1608D101BTA00: as FB1 on sheet HDMI; Datasheet: https://product.tdk.com/info/en/catalog/datasheets/beads_commercial_power_mpz1608_en.pdf; Manufacturer Part No.: MPZ1608D101BTA00; Supplier: Digi-Key; Package Description: 100 Ohms @ 100MHz 1 Power Line Ferrite Bead 0603 (1608 Metric) 1A 150mOhm; Supplier Part No.: 445-2988-1-ND; Package Reference: CAP_0603; Mounting Technology: SMD
J6 = 0672984090: CONN RCPT TYPEA STACKED 8POS R/A; Manufacturer: Molex; ComponentLink1 Description: Manufacturer; ComponentLink2 Description: Datasheet; ComponentLink1URL: http://www.we-online.de; ComponentLink2URL: http://katalog.we-online.de/em/datasheet/629105150521.pdf; Supplier: Digikey; Mounting Technology: THRU/SMD; Supplier Part No.: WM17130-ND; Package Description: CONN RCPT TYPEA STACKED 8POS R/A; Manufacturer Part No.: 0672984090; Package Reference: 0672984090; Datasheet: https://www.molex.com/pdm_docs/sd/672984090_sd.pdf
LED4 = LTST-C191KSKT: as LED2 on sheet P03_UART_Debug; ComponentLink1Description: Manufacturer; ComponentLink1URL: http://www.we-online.de; ComponentLink2Description: Datasheet; ComponentLink2URL: http://katalog.we-online.com/led/datasheet/150080BS75000.pdf; Color: Yellow; Manufacturer Part No.: LTST-C191KSKT; Supplier: Digi-Key; Package Reference: LED_0603; Supplier Part No.: 160-1448-1-ND; Mounting Technology: SMD; Datasheet: http://optoelectronics.liteon.com/upload/download/DS22-2000-224/LTST-C191KSKT.PDF
R79 R80 = RC0603FR-0710KL: as R1 on sheet HDMI; Tolerance: 1%; Manufacturer Part No.: RC0603FR-0710KL; Date: 2020; ComponentLink1Description: Manufacturer Link; ComponentLink1URL: http://www.vishay.com/company/brands/dale/; ComponentLink2Description: Datasheet; ComponentLink2URL: http://www.vishay.com/docs/20035/dcrcwe3.pdf; Supplier: Digikey; Supplier Part No.: 311-10.0KHRCT-ND; Datasheet: https://www.yageo.com/upload/media/product/productsearch/datasheet/rchip/PYu-RC_Group_51_RoHS_L_10.pdf; Package Reference: RES_0603; Package Description: 0603; Mounting Technology: SMD; Value: 10K; Power Rating: 1/10W
R81 R84 R120-R124 = RC0603FR-07100KL: as R14 on sheet HDMI; Tolerance: 1%; Manufacturer Part No.: RC0603FR-07100KL; Date: 2020; ComponentLink1Description: Manufacturer Link; ComponentLink1URL: http://www.vishay.com/company/brands/dale/; ComponentLink2Description: Datasheet; ComponentLink2URL: http://www.vishay.com/docs/20035/dcrcwe3.pdf; Supplier: Digikey; Supplier Part No.: 311-100KHRCT-ND; Datasheet: https://www.yageo.com/upload/media/product/productsearch/datasheet/rchip/PYu-RC_Group_51_RoHS_L_10.pdf; Package Reference: RES_0603; Package Description: 0603; Mounting Technology: SMD; Value: 100K; Power Rating: 1/10W
R83 = RC0603FR-071K5L: as R2 on sheet HDMI; Tolerance: 1%; Manufacturer Part No.: RC0603FR-071K5L; Date: 2020; ComponentLink1Description: Manufacturer Link; ComponentLink1URL: http://www.vishay.com/company/brands/dale/; ComponentLink2Description: Datasheet; ComponentLink2URL: http://www.vishay.com/docs/20035/dcrcwe3.pdf; Supplier: Digikey; Supplier Part No.: 311-1.50KHRCT-ND; Datasheet: https://www.yageo.com/upload/media/product/productsearch/datasheet/rchip/PYu-RC_Group_51_RoHS_L_10.pdf; Package Reference: RES_0603; Package Description: 0603; Mounting Technology: SMD; Value: 1.5K; Power Rating: 1/10W
R85 = RC0603JR-071ML: RES SMD 1M OHM 5% 1/10W 0603; Manufacturer: Yageo; Tolerance: 5%; Manufacturer Part No.: RC0603JR-071ML; Date: 2020; ComponentLink1Description: Manufacturer Link; ComponentLink1URL: http://www.vishay.com/company/brands/dale/; ComponentLink2Description: Datasheet; ComponentLink2URL: http://www.vishay.com/docs/20035/dcrcwe3.pdf; Supplier: Digikey; Supplier Part No.: 311-1.0MGRCT-ND; Datasheet: https://www.yageo.com/upload/media/product/productsearch/datasheet/rchip/PYu-RC_Group_51_RoHS_L_10.pdf; Package Reference: RES_0603; Package Description: 0603; Mounting Technology: SMD; Value: 1M; Power Rating: 1/10W
R86 = RMCF0603FT12K0: RES 12K OHM 1% 1/10W 0603; Manufacturer: Stackpole Electronics Inc; Tolerance: 1%; Manufacturer Part No.: RMCF0603FT12K0; Date: 2020; ComponentLink1Description: Manufacturer Link; ComponentLink1URL: http://www.vishay.com/company/brands/dale/; ComponentLink2Description: Datasheet; ComponentLink2URL: http://www.vishay.com/docs/20035/dcrcwe3.pdf; Supplier: Digikey; Supplier Part No.: RMCF0603FT12K0CT-ND; Datasheet: https://www.seielect.com/catalog/sei-rmcf_rmcp.pdf; Package Reference: RES_0603; Package Description: 0603; Mounting Technology: SMD; Power Rating: 1/10W; Value: 12k
U10 U11 = TPD4S012DRYR: TVS DIODE 5.5V 6SON; Manufacturer: Texas Instruments; Manufacturer Part No.: TPD4S012DRYR; ComponentLink1Description: Manufacturer Link; ComponentLink1URL: http://www.vishay.com/company/brands/dale/; ComponentLink2Description: Datasheet; ComponentLink2URL: http://www.vishay.com/docs/20035/dcrcwe3.pdf; Supplier: Digikey; Supplier Part No.: 296-24244-1-ND; Datasheet: http://www.ti.com/general/docs/suppproductinfo.tsp?distId=10&gotoUrl=http%3A%2F%2Fwww.ti.com%2Flit%2Fgpn%2Ftpd4s012; Package Reference: 6SON; Package Description: SON; Mounting Technology: SMD
U12 = TPS2051D: IC PWR SWITCH N-CHAN 1:1 8SOIC; Manufacturer: Texas Instruments; Manufacturer Part No.: TPS2051D; ComponentLink1Description: Manufacturer Link; ComponentLink1URL: http://www.vishay.com/company/brands/dale/; ComponentLink2Description: Datasheet; ComponentLink2URL: http://www.vishay.com/docs/20035/dcrcwe3.pdf; Supplier: Digikey; Supplier Part No.: 296-2576-5-ND; Datasheet: http://www.ti.com/lit/pdf/slvs172; Package Reference: 8-SOIC; Package Description: SOIC; Mounting Technology: SMD
U13 = USD2532-1080AEN: IC USB 2.0 HUB CTLR 2PORT 36SQFN; Manufacturer: Microchip Technology; Manufacturer Part No.: USB2532-1080AEN; ComponentLink1Description: Manufacturer Link; ComponentLink1URL: http://www.vishay.com/company/brands/dale/; ComponentLink2Description: Datasheet; ComponentLink2URL: http://www.vishay.com/docs/20035/dcrcwe3.pdf; Supplier: Digikey; Supplier Part No.: USB2532-1080AEN-ND; Datasheet: http://www.microchip.com/mymicrochip/filehandler.aspx?ddocname=en567006; Package Reference: 36SQFN; Package Description: QFN; Mounting Technology: SMD
Y3 = 7A-24.000MAAJ-T: CRYSTAL 24.0000MHZ 18PF SMD; Manufacturer: TXC CORPORATION; Date: 2020; ComponentLink1Description: Manufacturer Link; ComponentLink1URL: http://www.ecsxtal.com/; ComponentLink2Description: Data Sheet; Supplier Part No.: 887-1090-1-ND; Supplier: Digikey; Package Reference: 7A-24MHz; Package Description: 7A-24MHz; Mounting Technology: SMD; Manufacturer Part No.: 7A-24.000MAAJ-T; Datasheet: CRYSTAL 24.0000MHZ 18PF SMD; Value: 24 MHz